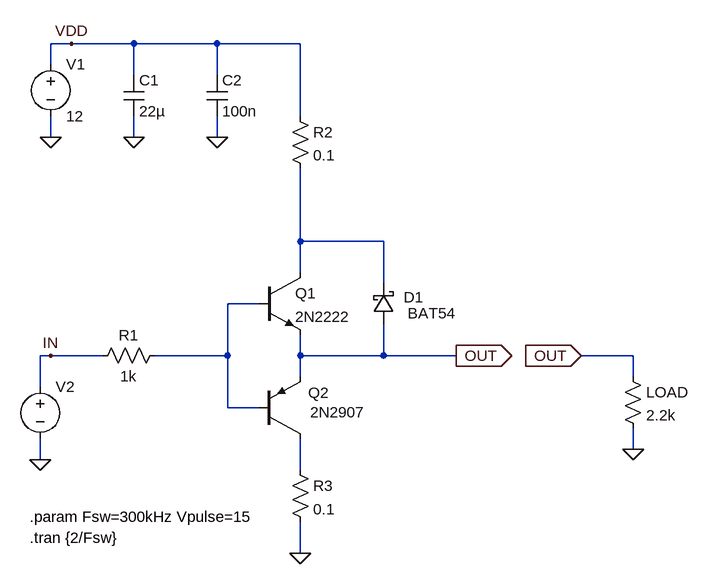
[diagram p0: schematic v1.0.asc]
v1.0.asc, the LTspice schematic file:
Version 4.1
SHEET 1 1380 680
WIRE 32 -288 0 -288
WIRE 128 -288 32 -288
WIRE 256 -288 128 -288
WIRE 384 -288 256 -288
WIRE 0 -256 0 -288
WIRE 128 -240 128 -288
WIRE 256 -240 256 -288
WIRE 384 -176 384 -288
WIRE 0 -144 0 -176
WIRE 128 -144 128 -176
WIRE 256 -144 256 -176
WIRE 384 16 384 -96
WIRE 512 16 384 16
WIRE 384 64 384 16
WIRE 512 80 512 16
WIRE 320 112 272 112
WIRE 0 192 -16 192
WIRE 80 192 0 192
WIRE 272 192 272 112
WIRE 272 192 160 192
WIRE 384 192 384 160
WIRE 512 192 512 144
WIRE 512 192 384 192
WIRE 624 192 512 192
WIRE 896 192 816 192
WIRE 384 224 384 192
WIRE 896 224 896 192
WIRE -16 240 -16 192
WIRE 272 272 272 192
WIRE 320 272 272 272
WIRE 896 336 896 304
WIRE -16 352 -16 320
WIRE 384 368 384 320
WIRE 384 496 384 448
FLAG 0 -144 0
FLAG 384 496 0
FLAG 624 192 OUT
IOPIN 624 192 Out
FLAG -16 352 0
FLAG 0 192 IN
FLAG 896 336 0
FLAG 816 192 OUT
IOPIN 816 192 In
FLAG 32 -288 VDD
FLAG 128 -144 0
FLAG 256 -144 0
SYMBOL npn 320 64 R0
SYMATTR InstName Q1
SYMATTR Value 2N2222
SYMBOL pnp 320 320 M180
WINDOW 0 76 71 Left 2
WINDOW 3 79 41 Left 2
SYMATTR InstName Q2
SYMATTR Value 2N2907
SYMBOL voltage 0 -272 R0
WINDOW 123 0 0 Left 0
WINDOW 39 0 0 Left 0
SYMATTR InstName V1
SYMATTR Value 12
SYMBOL res 64 208 R270
WINDOW 0 32 56 VTop 2
WINDOW 3 0 56 VBottom 2
SYMATTR InstName R1
SYMATTR Value 1k
SYMBOL voltage -16 224 R0
WINDOW 123 0 0 Left 0
WINDOW 39 0 0 Left 0
WINDOW 3 41 64 Invisible 2
SYMATTR Value PULSE(0 {Vpulse} 0 {0.01/Fsw} {0.01/Fsw} {0.5/Fsw} {1/Fsw})
SYMATTR InstName V2
SYMBOL res 880 208 R0
SYMATTR InstName LOAD
SYMATTR Value 2.2k
SYMBOL cap 112 -240 R0
SYMATTR InstName C1
SYMATTR Value 22µ
SYMBOL cap 240 -240 R0
SYMATTR InstName C2
SYMATTR Value 100n
SYMBOL res 368 -192 R0
SYMATTR InstName R2
SYMATTR Value 0.1
SYMBOL res 368 352 R0
SYMATTR InstName R3
SYMATTR Value 0.1
SYMBOL schottky 496 144 M180
WINDOW 0 47 42 Left 2
WINDOW 3 53 17 Left 2
SYMATTR InstName D1
SYMATTR Value BAT54
TEXT -32 472 Left 2 !.tran {2/Fsw}
TEXT -32 440 Left 2 !.param Fsw=300kHz Vpulse=15

The netlist it stands for:
* v1.0.asc
Q1 N001 N002 OUT 0 2N2222
Q2 N003 N002 OUT 0 2N2907
V1 VDD 0 12
R1 IN N002 1k
V2 IN 0 PULSE(0 {Vpulse} 0 {0.01/Fsw} {0.01/Fsw} {0.5/Fsw} {1/Fsw})
R§LOAD OUT 0 2.2k
C1 VDD 0 22µ
C2 VDD 0 100n
R2 VDD N001 0.1
R3 N003 0 0.1
D1 OUT N001 BAT54
.model D D
.lib standard.dio
.model NPN NPN
.model PNP PNP
.lib standard.bjt
.tran {2/Fsw}
.param Fsw=300kHz Vpulse=15
.backanno
.end